# EasyEDA schematic blue-jammer.json
TITLE: Sheet_1; REV: 1.0; Date: 2025-09-26; Sheet: 1/1; Drawn By: wout.moeskops; Company: Your Company
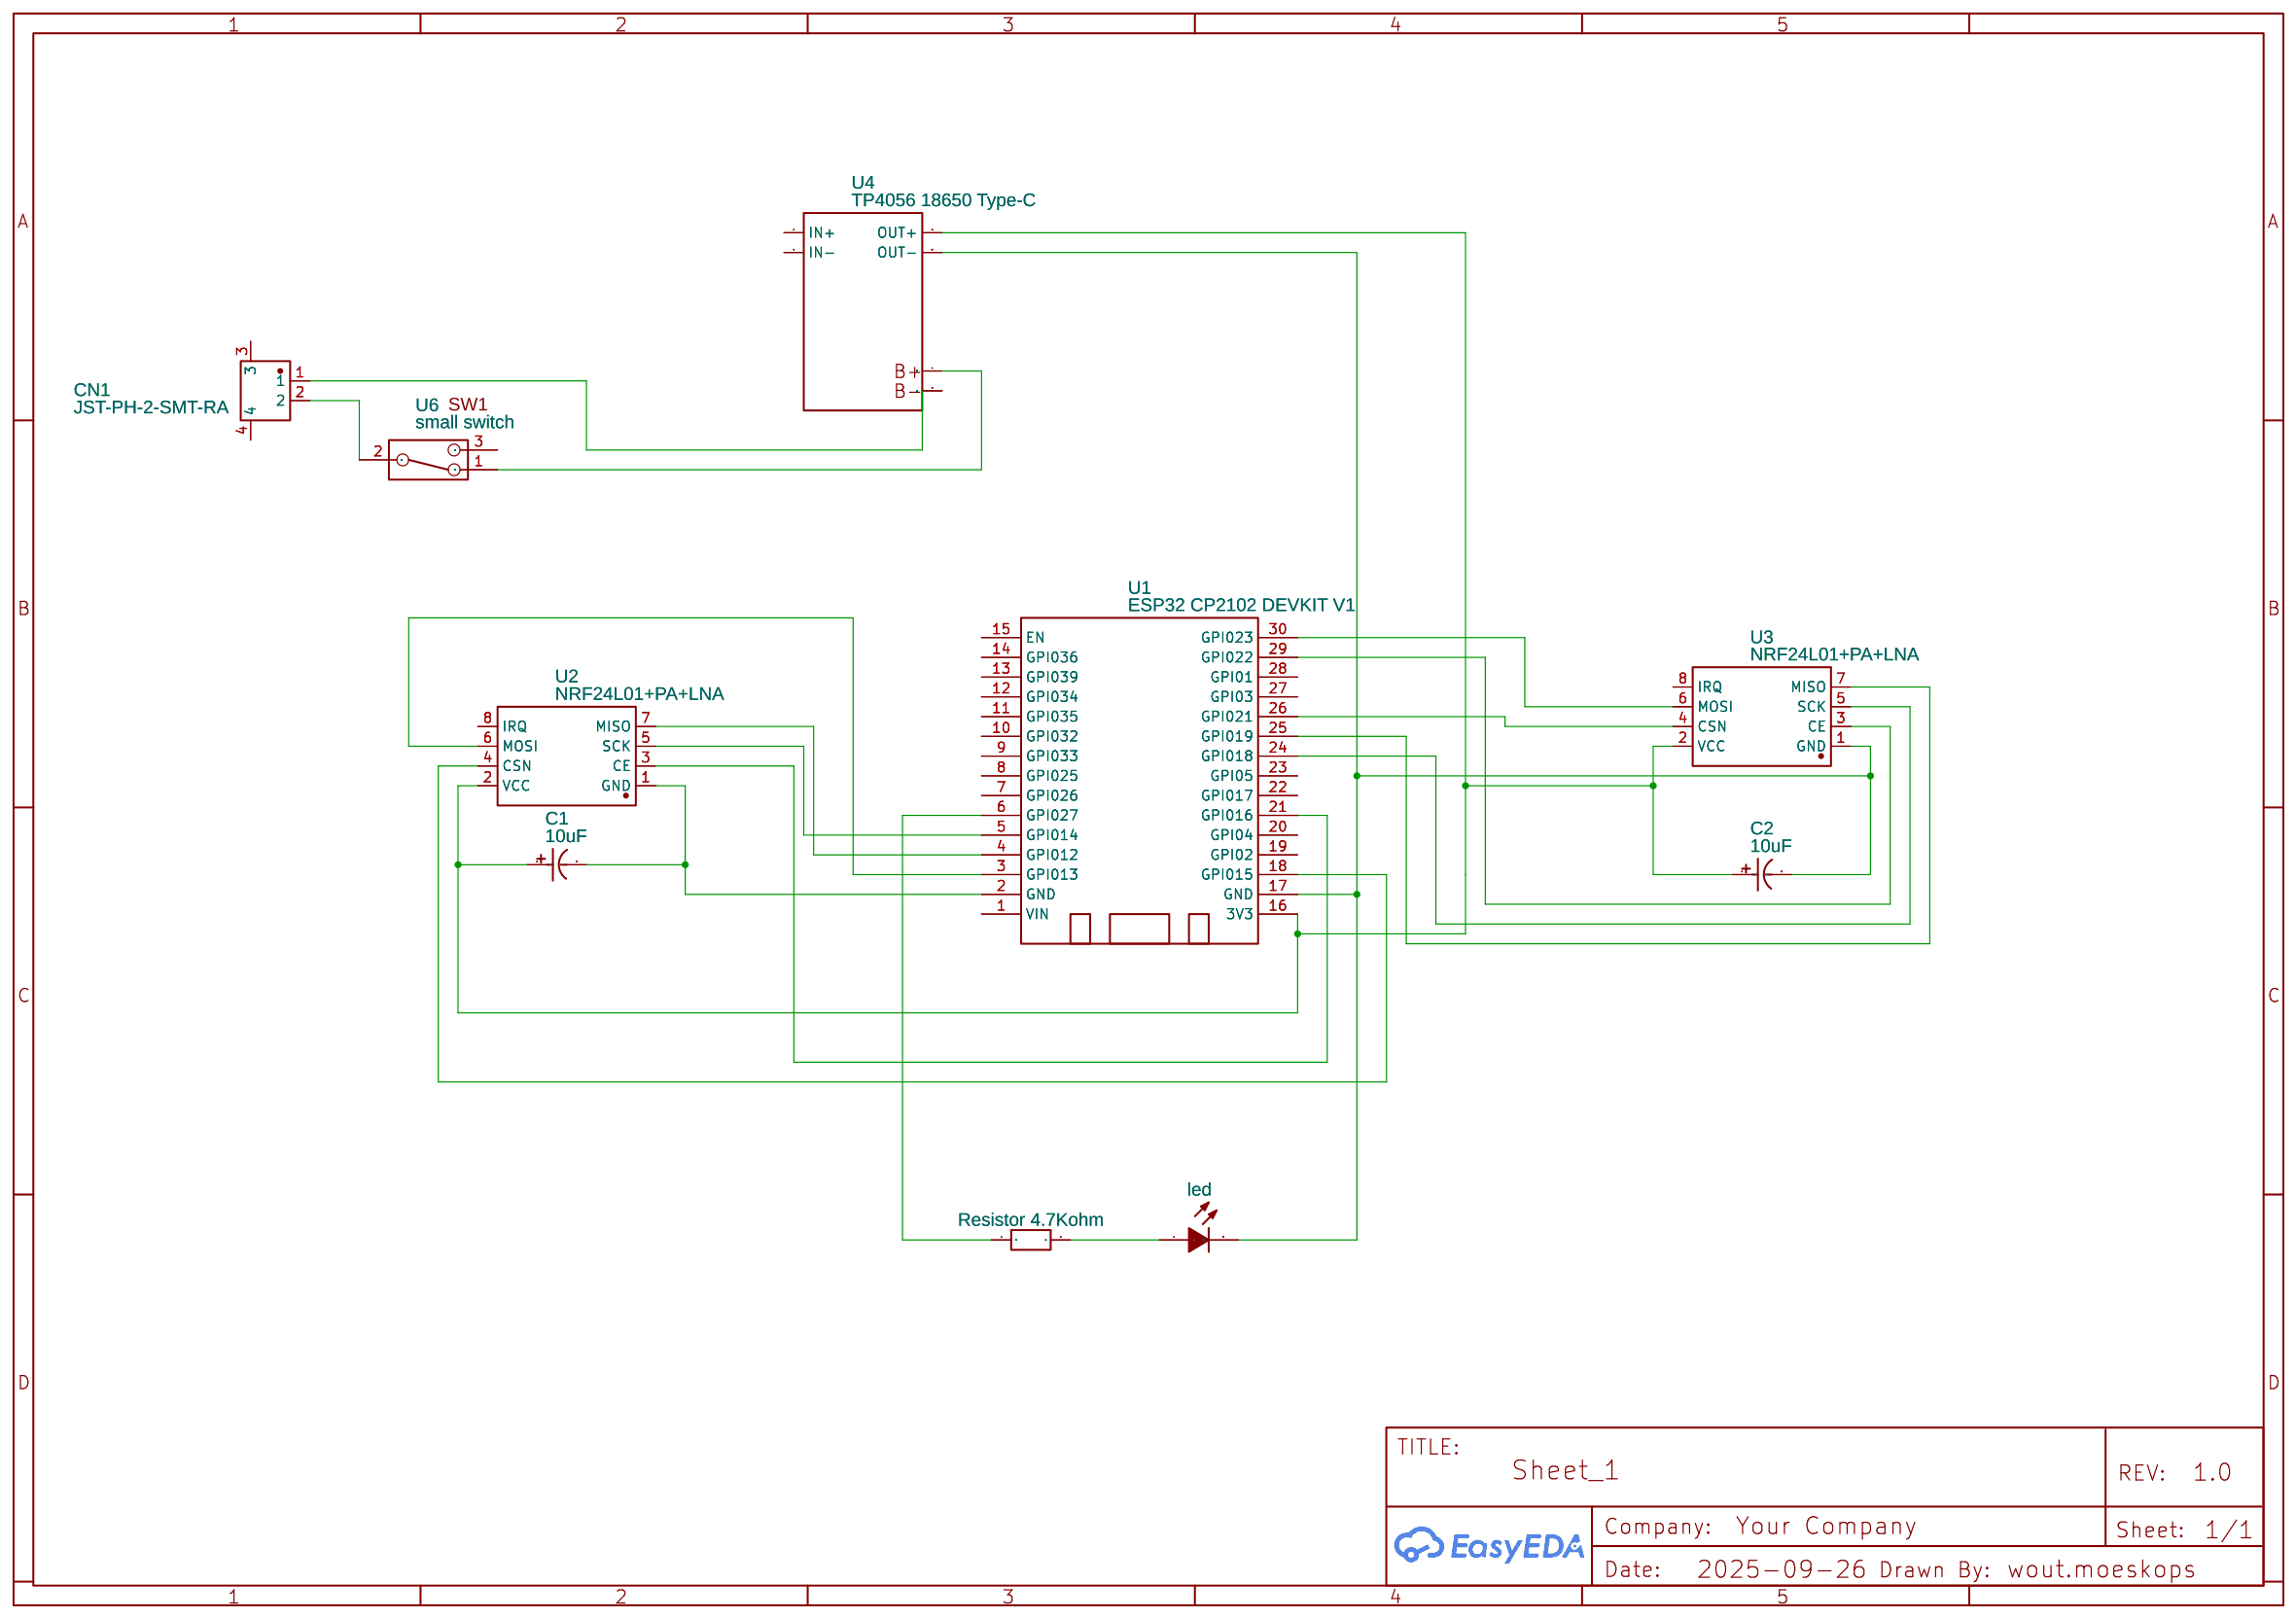
[diagram p0: schematic sheet]

## Parts
C1  10uF  [10UF 50V CAPACITOR]
C2  10uF  [10UF 50V CAPACITOR]
CN1  JST-PH-2-SMT-RA  [CONN-SMD_JST-PH-2-SMT-RA]
D2  led  [LED-TH_LED-DP2-2LED]
R2  Resistor 4.7Kohm  [560_AXIAL_1.2W1%_THA_239]
U1  ESP32 CP2102 DEVKIT V1  [DOIT-ESP32-DEVKIT-V1]
U2  NRF24L01+PA+LNA  [COMM-TH_L41.0-W15.5-P2.54_NRF24L01]
U3  NRF24L01+PA+LNA  [COMM-TH_L41.0-W15.5-P2.54_NRF24L01]
U4  TP4056 18650 Type-C  [TP4056 USB-C CHARGER]
U6  small switch  [SMALL SWITCH]

## Library data of the parts
C1 C2 = 10UF 50V CAPACITOR: Supplier: LCSC; Manufacturer: ValuePro; Manufacturer Part: electrolytic capacitor10UF50V; Supplier Part: C32856; JLCPCB Part Class: Extended Part
CN1 = JST-PH-2-SMT-RA: Supplier: LCSC; Supplier Part: C9900144926; Manufacturer: null; Contributor: lcsc
D2 = 3mm Green TH LED 5600: Supplier: Digi-Key; Manufacturer: VccLite; Manufacturer Part: 5600; Supplier Part: L20325-ND; link: https://vcclite.com/product/5602f5-5v/; Contributor: Raul Hejja
R2 = 560_Axial_1.2W1%_Tha_239: Supplier: LCSC; Supplier Part: C348838; Manufacturer: 1; Manufacturer Part: EWWR0001J20R0T9
U1 = ESP32 CP2102 DEVKIT V1: Contributor: ConceitoTeam
U2 U3 = NRF24L01+PA+LNA: Supplier: LCSC; Supplier Part: C9900187674; Manufacturer: null; Manufacturer Part: nRF24L01+PA+LNA; JLCPCB Part Class: Extended Part; Contributor: lcsc
U4 = TP4056 18650 Type-C: link: https://pl.aliexpress.com/item/1005001580997981.html?gatewayAdapt=glo2pol&spm=a2g0o.9042311.0.0.27425c0fA2TJwf; Contributor: Syrek1234
U6 = small switch: Contributor: pineywoodsdavid

## Nets
Net-(C1-1): C1.1(+) C2.1(+) U1.16(3V3) U2.2(VCC) U3.2(VCC) U4.3(OUT+)
Net-(C1-2): C1.2(-) U1.2(GND) U2.1(GND)
Net-(C2-2): C2.2(-) D2.2(K) U1.17(GND) U3.1(GND) U4.6(OUT-)
Net-(CN1-1): CN1.1 U4.5(BAT-)
Net-(CN1-2): CN1.2 U6.2
Net-(D2-1): D2.1(A) R2.2
Net-(R2-1): R2.1 U1.6(GPI027)
Net-(U1-3): U1.3(GPI013) U2.6(MOSI)
Net-(U1-4): U1.4(GPI012) U2.7(MISO)
Net-(U1-5): U1.5(GPI014) U2.5(SCK)
Net-(U1-18): U1.18(GPI015) U2.4(CSN)
Net-(U1-21): U1.21(GPI016) U2.3(CE)
Net-(U1-24): U1.24(GPI018) U3.5(SCK)
Net-(U1-25): U1.25(GPI019) U3.7(MISO)
Net-(U1-26): U1.26(GPI021) U3.4(CSN)
Net-(U1-29): U1.29(GPI022) U3.3(CE)
Net-(U1-30): U1.30(GPI023) U3.6(MOSI)
Net-(U4-4): U4.4(BAT+) U6.1

Not connected (* = marked no-connect by the designer): CN1 3 4; U1 1(VIN) 7(GPI026) 8(GPI025) 9(GPI033) 10(GPI032) 11(GPI035) 12(GPI034) 13(GPI039) 14(GPI036) 15(EN) 19(GPI02) 20(GPI04) 22(GPI017) 23(GPI05) 27(GPI03) 28(GPI01); U2 8(IRQ); U3 8(IRQ); U4 1(IN+) 2(IN-); U6 3
